# Altium schematic sheet Sheet2.SchDoc
size A4
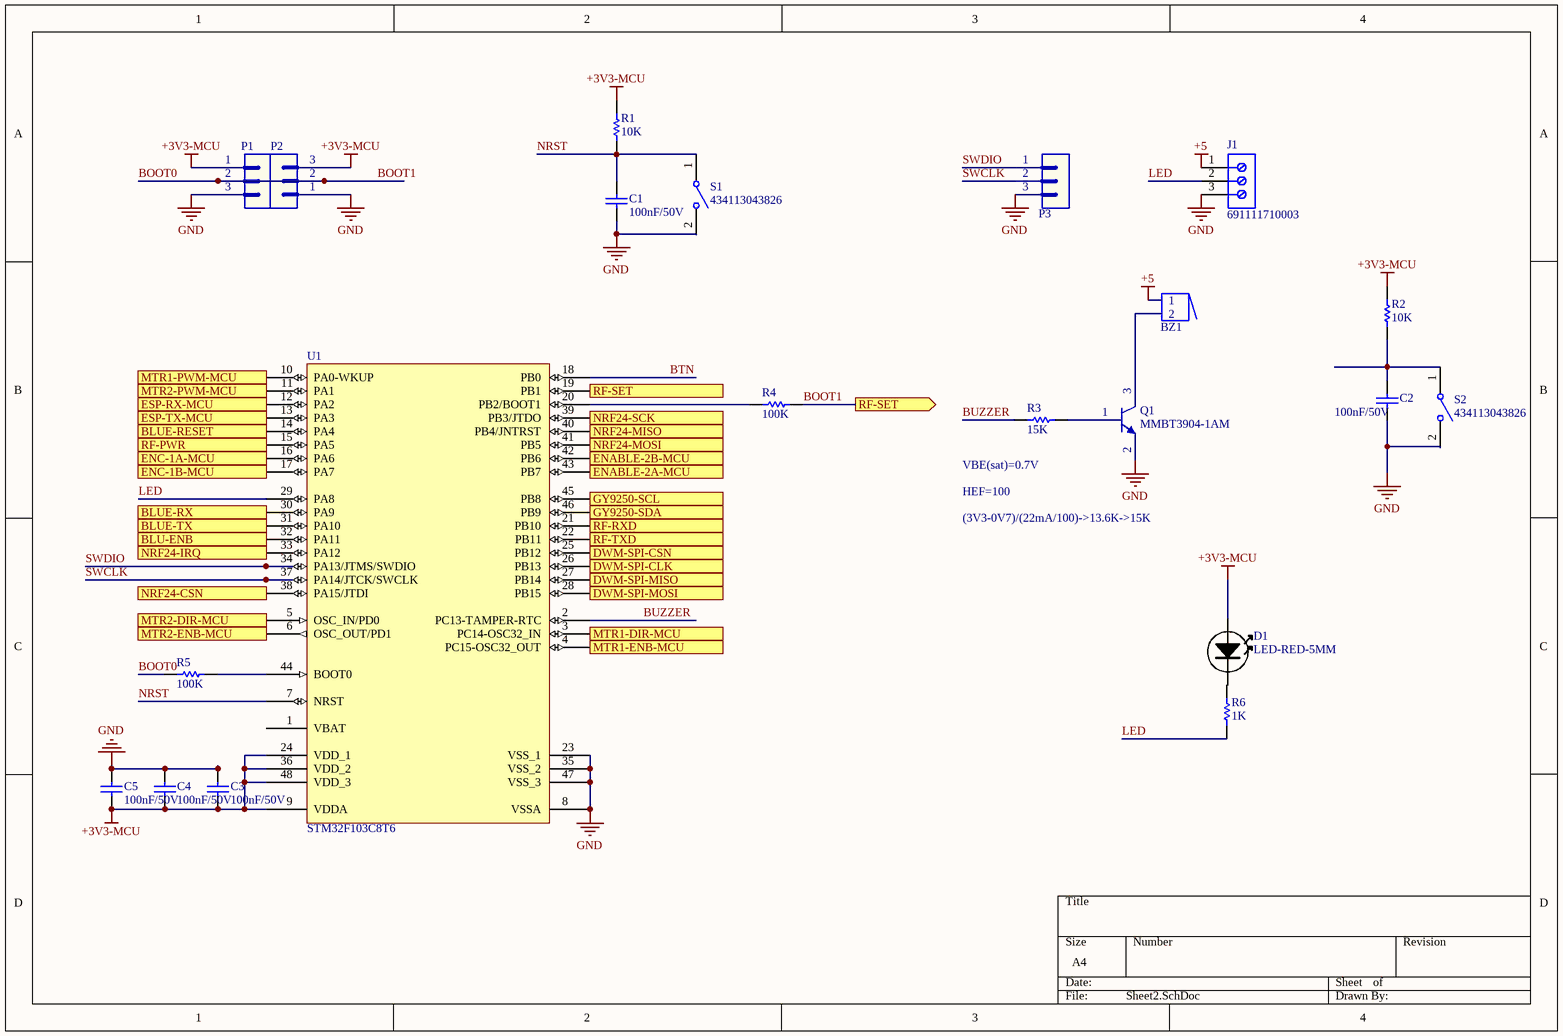
[diagram p0: Sheet2.SchDoc]

## Parts
BZ1  Buzzer  [BUZZER]  (value not drawn)
C1  value 100nF/50V  [CAP-SM-0805]  (hidden comment: Cap-100nF-50V-0805)
C2  value 100nF/50V  [CAP-SM-0805]  (hidden comment: Cap-100nF-50V-0805)
C3  value 100nF/50V  [CAP-SM-0805]  (hidden comment: Cap-100nF-50V-0805)
C4  value 100nF/50V  [CAP-SM-0805]  (hidden comment: Cap-100nF-50V-0805)
C5  value 100nF/50V  [CAP-SM-0805]  (hidden comment: Cap-100nF-50V-0805)
D1  LED-RED-5MM  [LED-5MM-RED]
J1  691111710003  [691111710003]
P1  Header 3  [JP3]  (value not drawn)
P2  Header 3  [JP3]  (value not drawn)
P3  Header 3  [JP3]  (value not drawn)
Q1  MMBT3904-1AM  [SOT23_NEX]
R1  value 10K  [RES-SM-0805]  (hidden comment: Res-10k-0805)
R2  value 10K  [RES-SM-0805]  (hidden comment: Res-10k-0805)
R3  value 15K  [RES-SM-0805]  (hidden comment: Res-15K-0805)
R4  value 100K  [RES-SM-0805]  (hidden comment: Res-100K-0805)
R5  value 100K  [RES-SM-0805]  (hidden comment: Res-100K-0805)
R6  value 1K  [RES-SM-0805]  (hidden comment: Res-1K-0805)
S1  434113043826  [434113043826]
S2  434113043826  [434113043826]
U1  STM32F103C8T6  [LQFP48_N]

## Ports
BLU-ENB (out), BLUE-RESET (out), BLUE-RX (out), BLUE-TX (in), DWM-SPI-CLK (out), DWM-SPI-CSN (out), DWM-SPI-MISO (in), DWM-SPI-MOSI (out), ENABLE-2A-MCU (in), ENABLE-2B-MCU (in), ENC-1A-MCU (in), ENC-1B-MCU (in), ESP-RX-MCU (out), ESP-TX-MCU (in), GY9250-SCL (out), GY9250-SDA (out), MTR1-DIR-MCU (out), MTR1-ENB-MCU (out), MTR1-PWM-MCU (out), MTR2-DIR-MCU (out), MTR2-ENB-MCU (out), MTR2-PWM-MCU (out), NRF24-CSN (out), NRF24-IRQ (in), NRF24-MISO (in), NRF24-MOSI (out), NRF24-SCK (out), RF-PWR (out), RF-RXD (out), RF-SET (out), RF-TXD (in)

## Nets
+3V3-MCU: C3.1 C4.1 C5.1 D1.A P1.1 P2.3 R1.2 R2.2 U1.9(VDDA) U1.24(VDD_1) U1.36(VDD_2) U1.48(VDD_3)
+5: BZ1.1 J1.1
GND: C1.1 C2.2 C3.2 C4.2 C5.2 J1.3 P1.3 P2.1 P3.3 Q1.2(E) S1.2 S2.2 U1.8(VSSA) U1.23(VSS_1) U1.35(VSS_2) U1.47(VSS_3)
BLU-ENB: U1.32(PA11) ; port BLU-ENB
BLUE-RESET: U1.14(PA4) ; port BLUE-RESET
BLUE-RX: U1.30(PA9) ; port BLUE-RX
BLUE-TX: U1.31(PA10) ; port BLUE-TX
BOOT0: P1.2 P2.2 R4.2 R5.1 U1.19(PB1) ; port RF-SET  [also labelled BOOT1]
BTN: U1.18(PB0)
BUZZER: R3.1 U1.2(PC13-TAMPER-RTC)
DWM-SPI-CLK: U1.26(PB13) ; port DWM-SPI-CLK
DWM-SPI-CSN: U1.25(PB12) ; port DWM-SPI-CSN
DWM-SPI-MISO: U1.27(PB14) ; port DWM-SPI-MISO
DWM-SPI-MOSI: U1.28(PB15) ; port DWM-SPI-MOSI
ENABLE-2A-MCU: U1.43(PB7) ; port ENABLE-2A-MCU
ENABLE-2B-MCU: U1.42(PB6) ; port ENABLE-2B-MCU
ENC-1A-MCU: U1.16(PA6) ; port ENC-1A-MCU
ENC-1B-MCU: U1.17(PA7) ; port ENC-1B-MCU
ESP-RX-MCU: U1.12(PA2) ; port ESP-RX-MCU
ESP-TX-MCU: U1.13(PA3) ; port ESP-TX-MCU
GY9250-SCL: U1.45(PB8) ; port GY9250-SCL
GY9250-SDA: U1.46(PB9) ; port GY9250-SDA
LED: J1.2 R6.1 U1.29(PA8)
MTR1-DIR-MCU: U1.3(PC14-OSC32_IN) ; port MTR1-DIR-MCU
MTR1-ENB-MCU: U1.4(PC15-OSC32_OUT) ; port MTR1-ENB-MCU
MTR1-PWM-MCU: U1.10(PA0-WKUP) ; port MTR1-PWM-MCU
MTR2-DIR-MCU: U1.5(OSC_IN/PD0) ; port MTR2-DIR-MCU
MTR2-ENB-MCU: U1.6(OSC_OUT/PD1) ; port MTR2-ENB-MCU
MTR2-PWM-MCU: U1.11(PA1) ; port MTR2-PWM-MCU
NRF24-CSN: U1.38(PA15/JTDI) ; port NRF24-CSN
NRF24-IRQ: U1.33(PA12) ; port NRF24-IRQ
NRF24-MISO: U1.40(PB4/JNTRST) ; port NRF24-MISO
NRF24-MOSI: U1.41(PB5) ; port NRF24-MOSI
NRF24-SCK: U1.39(PB3/JTDO) ; port NRF24-SCK
NRST: C1.2 R1.1 S1.1 U1.7(NRST)
RF-PWR: U1.15(PA5) ; port RF-PWR
RF-RXD: U1.21(PB10) ; port RF-RXD
RF-TXD: U1.22(PB11) ; port RF-TXD
SWCLK: P3.2 U1.37(PA14/JTCK/SWCLK)
SWDIO: P3.1 U1.34(PA13/JTMS/SWDIO)
NetBZ1_2: BZ1.2 Q1.3(C)
NetC2_1: C2.1 R2.1 S2.1
NetQ1_1: Q1.1(B) R3.2
NetR4_1: R4.1 U1.20(PB2/BOOT1)
NetR5_2: R5.2 U1.44(BOOT0)

Not connected (* = marked no-connect by the designer): D1 K; R6 2; U1 1(VBAT)

## Notes on the sheet
- (near R3) VBE(sat)=0.7V
- HEF=100
- (3V3-0V7)/(22mA/100)->13.6K->15K

## Library data of the parts
C1-C5 = Cap-100nF-50V-0805: CAP CER 0.1UF 50V Y5V 0805; Manufacturer: Samsung Electro-Mechanics; Manufacturer Part Number: CL21F104ZBCNNNC; Local Supplier: thegioiic; Local Supplier Link: https://thegioiic.com/products/tu-100nf-0-1uf-50v-0805; Supplier 1: Digikey; Supplier 1 Part Number: 1276-1007-1-ND; Supplier 1 Link: https://www.digikey.com/product-detail/en/samsung-electro-mechanics/CL21F104ZBCNNNC/1276-1007-1-ND/3889093
J1 = 691111710003: WR-TBL Serie 111 Horizontal Entry Modular, Pressure Clamp, pitch 5mm, 3p; Compliance: Lead free / RoHS; Modularity: Yes; PCB/Cable/Panel: PCB; Pin Number: 3; Rated Current [UL]: 15A; Working Voltage [UL]: 250VAC; ComponentLink1Description: Manufacturer; ComponentLink1URL: http://www.we-online.de; ComponentLink2URL: https://katalog.we-online.de/em/datasheet/691111710003.pdf; ComponentLink2Description: Datasheet; Mounting Technology: THT; Part Number: 691111710003; Packaging: Box; Operating Temperature: -40 to +105degC; Pitch: 5mm; Published Date: October 2019; Type: Horizontal; Publisher: Wurth Elektronik; Application: Pressure Clamp
P1-P3 = Header 3: Header, 3-Pin; LatestRevisionDate: 17-Jul-2002; LatestRevisionNote: Re-released for DXP Platform.; Publisher: Altium Limited
R1 R2 = Res-10k-0805: RES 10K OHM 1% 1/4W 0805; Manufacturer: Stackpole Electronics Inc; Manufacturer Part Number: RNCP0805FTD10K0; Local Supplier: thegioiic; Local Supplier Link: https://thegioiic.com/products/dien-tro-10k-ohm-0805-5; Supplier 1: Digikey; Supplier 1 Link: https://www.digikey.com/product-detail/en/stackpole-electronics-inc/RNCP0805FTD10K0/RNCP0805FTD10K0CT-ND/2240601; Supplier 1 Part Number: RNCP0805FTD10K0CT-ND
R3 = Res-15K-0805: RES 15K OHM 1% 1/4W 0805; Manufacturer: TE Connectivity Passive Product; Manufacturer Part Number: CRGCQ0805F15K; Local Supplier: thegioiic; Local Supplier Link: https://thegioiic.com/products/dien-tro-15k-ohm-0805-1; Supplier 1: Digikey; Supplier 1 Part Number: A129763CT-ND; Supplier 1 Link: https://www.digikey.com/product-detail/en/te-connectivity-passive-product/CRGCQ0805F15K/A129763CT-ND/8577595
R4 R5 = Res-100K-0805: RES 0 OHM JUMPER 0805; Manufacturer: Vishay Dale; Manufacturer Part Number: WSL080500000ZEA9; Local Supplier: thegioiic; Local Supplier Link: https://thegioiic.com/products/dien-tro-0-ohm-0805-5; Supplier 1: Digikey; Supplier 1 Link: https://www.digikey.com/product-detail/en/vishay-dale/WSL080500000ZEA9/541-3928-1-ND/7423223; Supplier 1 Part Number: 541-3928-1-ND
R6 = Res-1K-0805: RES 1K OHM 1% 1/4W 0805; Manufacturer: Stackpole Electronics Inc; Manufacturer Part Number: RNCP0805FTD1K00; Local Supplier: thegioiic; Local Supplier Link: https://thegioiic.com/products/dien-tro-1k-ohm-0805-5; Supplier 1: Digikey; Supplier 1 Link: https://www.digikey.com/product-detail/en/stackpole-electronics-inc/RNCP0805FTD1K00/RNCP0805FTD1K00CT-ND/2240568; Supplier 1 Part Number: RNCP0805FTD1K00CT-ND
S1 S2 = 434113043826: WS-TASV J-Bend SMT Tact Switch 6x3.5mm, height 4.3mm, 260gf; Rated Voltage: 12VDC; Rated Current: 50mA; Washable: No; ComponentLink1Description: Manufacturer; ComponentLink1URL: http://www.we-online.de; ComponentLink2Description: Datasheet; ComponentLink2URL: https://katalog.we-online.com/em/datasheet/434113043826.pdf; Operating Temperature: -40 to +85degC; Part Number: 434113043826; Published Date: September 2019; Contact Material: Stainless Steel; Height: 4.3mm; Mounting Technology: SMT; Contact Plating: Silver; Operation Force: 260gf; Packaging: Tape and Reel; Terminal Material: Copper Alloy; Publisher: Wurth Elektronik; Terminal Plating: Silver
U1 = STM32F103C8T6: STM32 ARM-based 32-bit MCU with 64 Kbytes Flash, 48-pin LQFP, Industrial Temperature; Published: 30-May-2008; DatasheetVersion: rev6, Mar-2008; PackageVersion: Mar-2008; PackageReference: LQFP48; Publisher: Altium Limited; PackageDescription: 48-Pin Low-Profile Quad Flat Pack, 7 x 7 mm Body, 0.5 mm Pitch (LQFP48); ComponentLink1Description: Manufacturer Link; ComponentLink1URL: www.st.com/stm32; ComponentLink2Description: Datasheet; ComponentLink2URL: http://www.st.com/stonline/products/literature/ds/13587.pdf